# EasyEDA schematic RC_CAR_Tx.json
TITLE: Sheet_1; REV: 1.0; Date: 2025-01-01; Sheet: 1/1; Drawn By: harsh2003; Company: Your Company
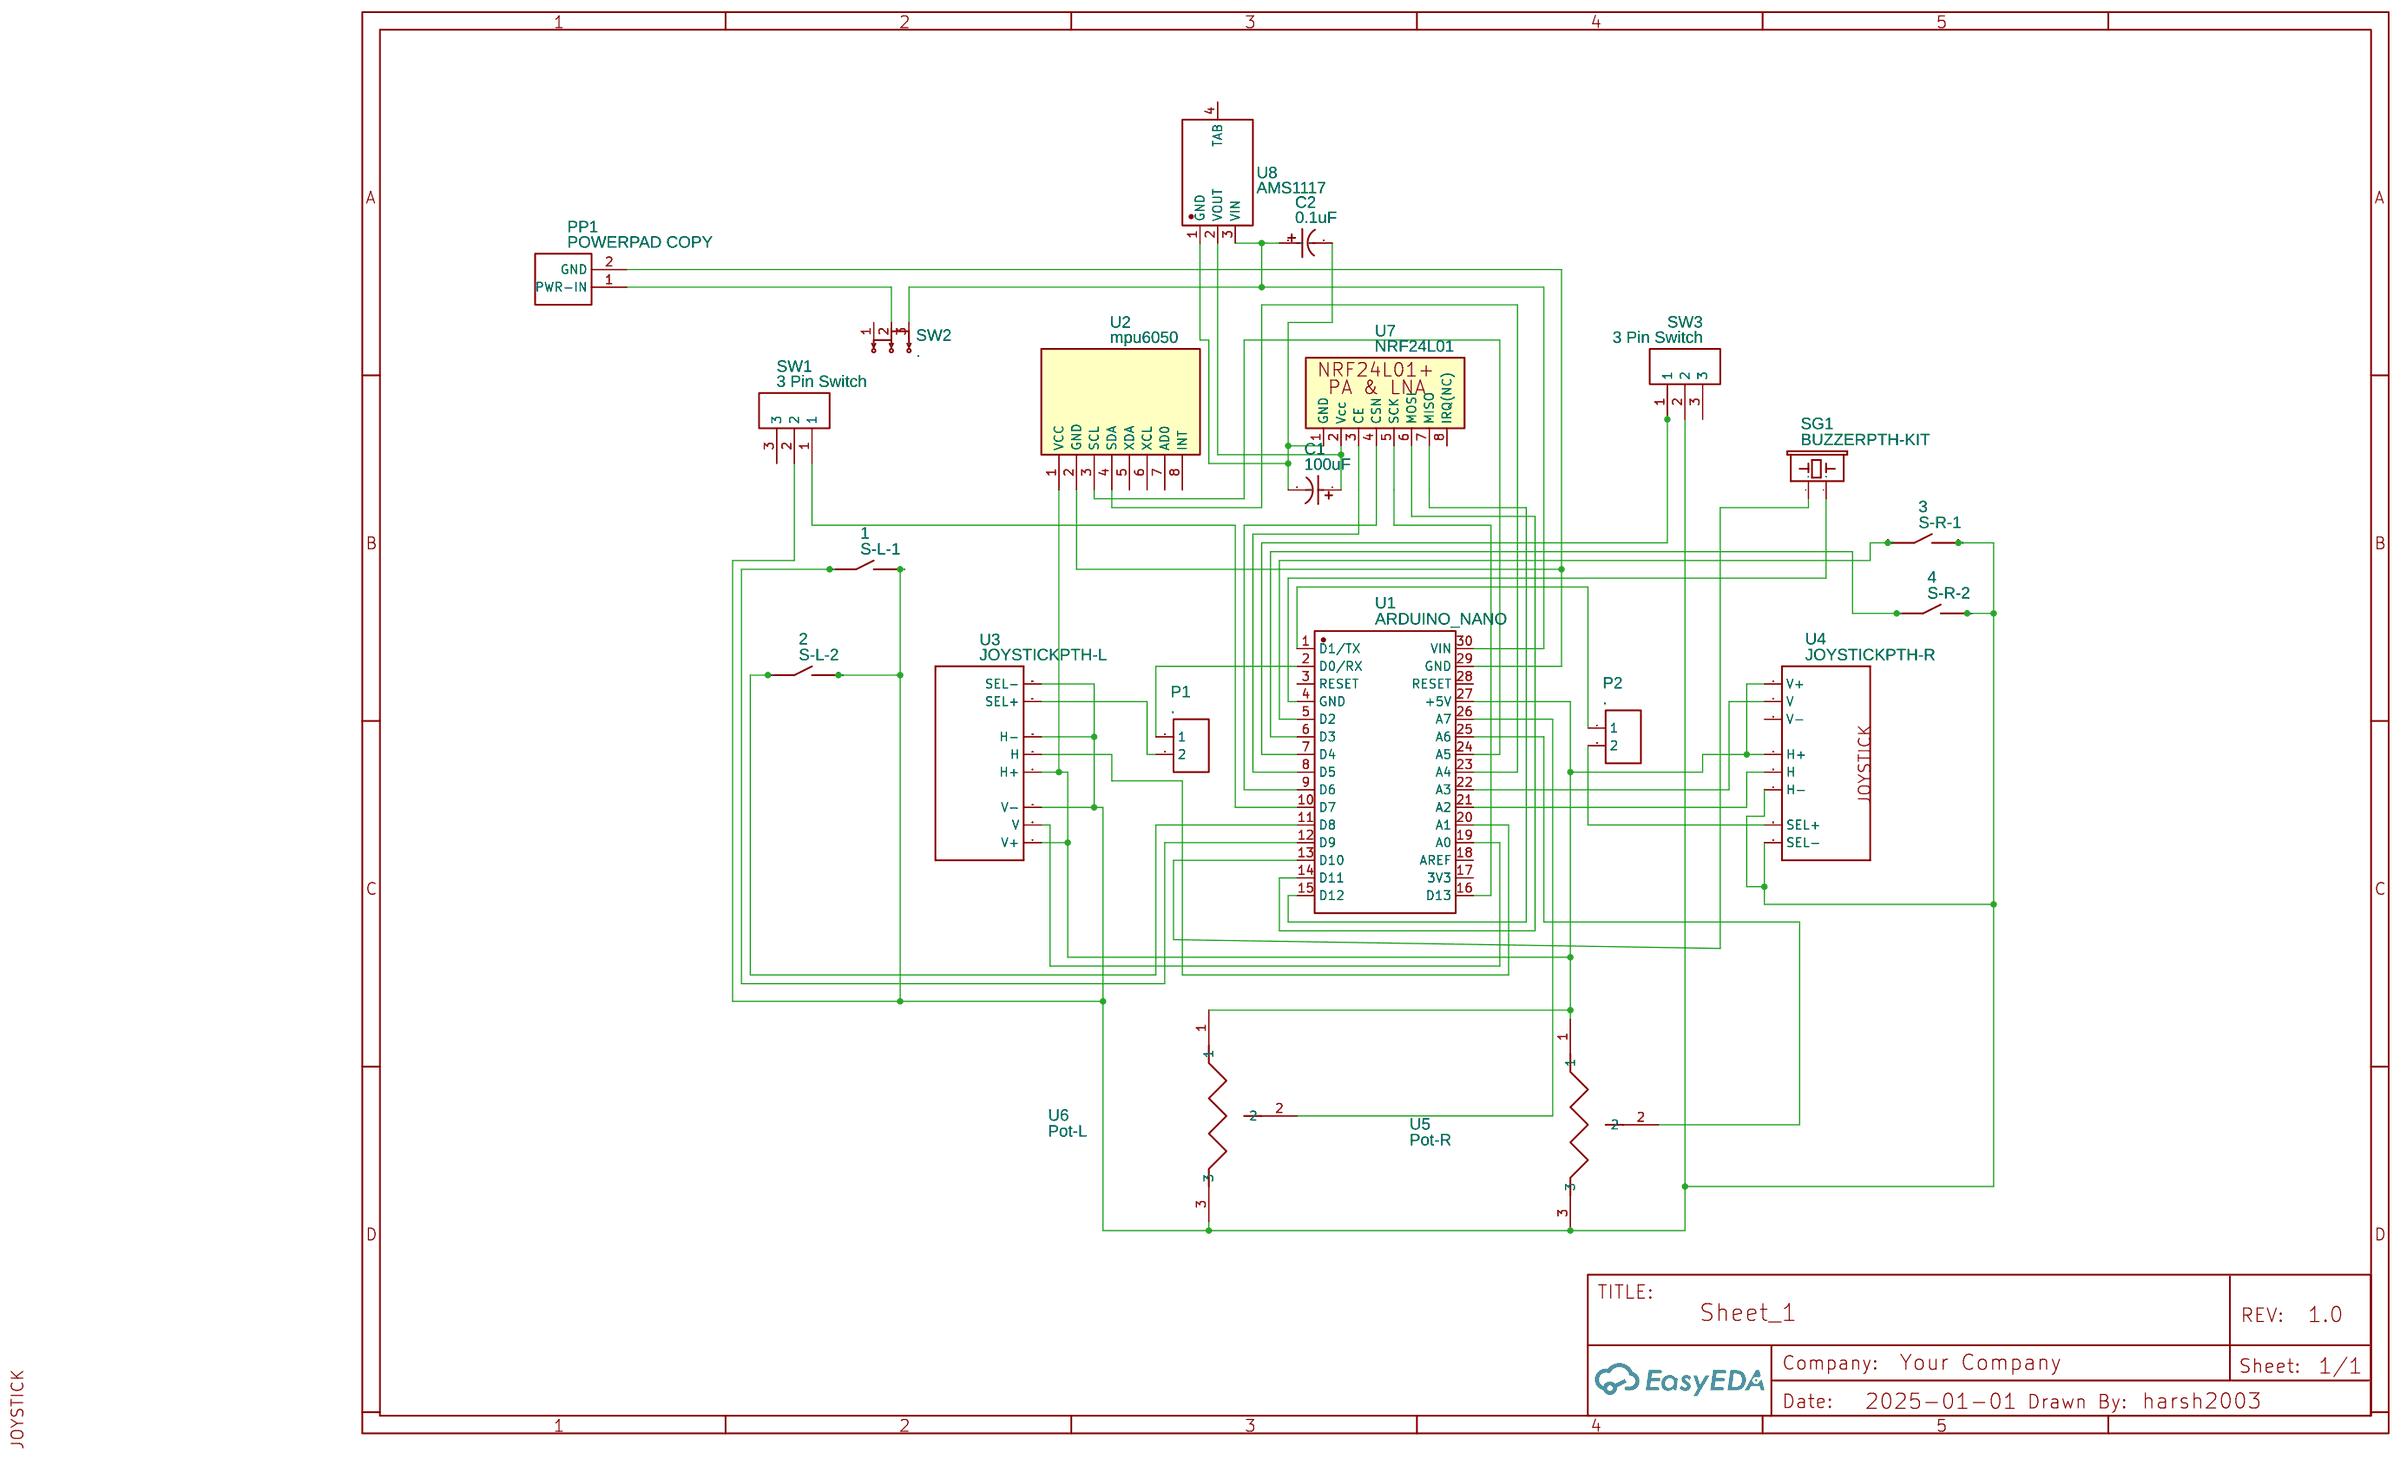
[diagram p0: schematic sheet]

## Parts
1  S-L-1  [SMD-4.5X4.5-TACTILE-PUSH-BUTTON]
2  S-L-2  [SMD-4.5X4.5-TACTILE-PUSH-BUTTON]
3  S-R-1  [SMD-4.5X4.5-TACTILE-PUSH-BUTTON]
4  S-R-2  [SMD-4.5X4.5-TACTILE-PUSH-BUTTON]
C1  100uF  [CAP-TH_BD6.3-P2.50-D1.0-FD]
C2  0.1uF  [CAP-TH_BD6.3-P2.50-D1.0-FD]
P1  .  [HDR-TH_2P-P2.54-V-F]
P2  .  [HDR-TH_2P-P2.54-V-F]
PP1  POWERPAD COPY  [POWERPAD]
SG1  BUZZERPTH-KIT  [BUZZER-12MM-KIT]
SW1  3 Pin Switch  [BENDING PIN MINI TOGGLE SWITCH (1P2T) SPDT SLIDE SWITCH 50V]
SW2  .  [SW-TH_G-SWITCH_SS-12F20-G070]
SW3  3 Pin Switch  [BENDING PIN MINI TOGGLE SWITCH (1P2T) SPDT SLIDE SWITCH 50V]
U1  ARDUINO_NANO  [COMM-TH_ARDUINO_NANO]
U2  mpu6050  [MPU6050]
U3  JOYSTICKPTH-L  [JOYSTICK]
U4  JOYSTICKPTH-R  [JOYSTICK]
U5  Pot-R  [10K POTENTIOMETER]
U6  Pot-L  [10K POTENTIOMETER]
U7  NRF24L01  [NRF24L01+PA+LNA_PCB]
U8  AMS1117  [SOT-223-3_L6.5-W3.4-P2.30-LS7.0-BR]

## Library data of the parts
1-4 = 4.5X4.5-SMD-TACTILE-SWITCH: Contributor: Aman Verma
C1 = 100uF 25V 6.3*11: Supplier: LCSC; Manufacturer: null; Supplier Part: C44589; JLCPCB Part Class: Extended Part
C2 = KF221M010E110A: Supplier: LCSC; Manufacturer: CapXon(丰宾); Supplier Part: C59331; JLCPCB Part Class: Extended Part
P1 P2 = Header-Female-2.54_1x2: Supplier: LCSC; Manufacturer: BOOMELE(博穆精密); Manufacturer Part: 2.54-1*2P母; Supplier Part: C49661; JLCPCB Part Class: Extended Part
PP1 = POWERPAD COPY: Contributor: Petr Tůma
SG1 = BUZZERPTH-KIT: Buzzer 12mm; Contributor: SparkFun
SW1 SW3 = 3 Pin Switch: Manufacturer: Dongguan Kaifeng Electronic Technology Limited; Manufacturer Part: SS12D06; Supplier: Alibaba; Supplier Part: SS12D06; link: https://www.alibaba.com/product-detail/KaiFeng-SS12D06-Three-Wrestling-Pin-Slide_62168688714.html?spm=a2700.7724838.2017115.14.2697ec44KNew8q; Contributor: mary1; Link: https://www.alibaba.com/product-detail/KaiFeng-SS12D06-Three-Wrestling-Pin-Slide_62168688714.html?spm=a2700.7724838.2017115.14.2697ec44KNew8q; Price: $0.06
SW2 = SS-12F20-G070: Contributor: LCSC; Supplier: LCSC; Supplier Part: C2848914; Manufacturer: G-Switch(品赞); JLCPCB Part Class: Extended Part
U1 = ARDUINO_NANO: Contributor: lcsc; Supplier: LCSC; Supplier Part: C9900017879; Manufacturer: null; JLCPCB Part Class: Extended Part
U2 = mpu6050: Contributor: tasafut013
U3 U4 = JOYSTICKPTH copy: Thumb Joystick; Contributor: SparkFun
U5 U6 = 100k potentiometer: Contributor: veilerik
U7 = AR_NRF24L01+PA+LNA: Manufacturer Part: NRF24L01+; Contributor: ar43; Manufacturer: Fo2sh
U8 = AMS1117-1.8_C498120: Contributor: LCSC; Supplier: LCSC; Supplier Part: C498120; Manufacturer: HGC(华冠); Manufacturer Part: AMS1117-1.8; JLCPCB Part Class: Extended Part

## Nets
Net-(1-1.1): 1.1.1(S1) 1.1.2(S1) U1.12(D9)
Net-(1-2.1): 1.2.1(S2) 1.2.2(S2) 2.2.1(S2) 2.2.2(S2) 3.2.1(S2) 3.2.2(S2) 4.2.1(S2) 4.2.2(S2) SW1.2 SW3.2 U3.B2A(SEL-) U3.H3(H-) U3.V3(V-) U4.B2A(SEL-) U4.H3(H-) U5.3 U6.3
Net-(2-1.1): 2.1.1(S1) 2.1.2(S1) U1.11(D8)
Net-(3-1.1): 3.1.1(S1) 3.1.2(S1) U1.5(D2)
Net-(4-1.1): 4.1.1(S1) 4.1.2(S1) U1.6(D3)
Net-(C1-1): C1.1 U7.2(Vcc) U8.2(VOUT)
Net-(C1-2): C1.2 C2.2 U7.1(GND) U8.1(GND)
Net-(C2-1): C2.1 SW2.3 U1.30(VIN) U8.3(VIN)
Net-(P1-1): P1.1 U1.2(D0/RX)
Net-(P1-2): P1.2 U3.B1A(SEL+)
Net-(P2-1): P2.1 U1.1(D1/TX)
Net-(P2-2): P2.2 U4.B1A(SEL+)
Net-(PP1-1): PP1.1(PWR-IN) SW2.2
Net-(PP1-2): PP1.2(GND) U1.29(GND) U2.2(GND)
Net-(SG1-+): SG1.+(1) U1.13(D10)
Net-(SG1--): SG1.-(2) U1.4(GND)
Net-(SW1-1): SW1.1 U1.10(D7)
Net-(SW3-1): SW3.1 U1.7(D4)
Net-(U1-8): U1.8(D5) U7.3(CE)
Net-(U1-9): U1.9(D6) U7.4(CSN)
Net-(U1-14): U1.14(D11) U7.6(MOSI)
Net-(U1-15): U1.15(D12) U7.7(MISO)
Net-(U1-16): U1.16(D13) U7.5(SCK)
Net-(U1-19): U1.19(A0) U3.V2(V)
Net-(U1-20): U1.20(A1) U3.H2(H)
Net-(U1-21): U1.21(A2) U4.H2(H)
Net-(U1-22): U1.22(A3) U4.V2(V)
Net-(U1-23): U1.23(A4) U2.4(SDA)
Net-(U1-24): U1.24(A5) U2.3(SCL)
Net-(U1-25): U1.25(A6) U5.2
Net-(U1-26): U1.26(A7) U6.2
Net-(U1-27): U1.27(+5V) U2.1(VCC) U3.H1(H+) U3.V1(V+) U4.H1(H+) U4.V1(V+) U5.1 U6.1

Not connected (* = marked no-connect by the designer): SW1 3; SW2 1; SW3 3; U1 3(RESET) 17(3V3) 18(AREF) 28(RESET); U2 5(XDA) 6(XCL) 7(AD0) 8(INT); U4 V3(V-); U7 8(IRQ(NC)); U8 4(TAB)
